# Altium project MCU063A.PrjPcb (part 2 of 5)

## Sheet MCU063A_ADC.SchDoc
size 431 x 279 mm; Date: Not shown in title block; ApprovedBy: Not shown in title block; CheckedBy: Not shown in title block; Author: Not shown in title block; CompanyName: Not shown in title block; DrawnBy: Cody Watkins; Engineer: Not shown in title block; Organization: Not shown in title block; Address1: Not shown in title block; Address2: Not shown in title block; Address3: Not shown in title block; Address4: Not shown in title block; DocumentNumber: 4; Revision: Use project parameter SCH_Rev; SheetNumber: 4; SheetTotal: 11; PageSetup: Record=PageOptions|CenterHorizontal=True|CenterVertical=True|PrintScale=1.00|XCorrection=1.00|YCorrection=1.00|PrintKind=0|BorderSize=5000000|LeftOffset=0|BottomOffset=0|Orientation=2|PaperLength=1000|PaperWidth=1000|Scale=100|PaperSource=15|PrintQuality=600|MediaType=1|DitherType=10|PaperKind=Letter|PrintScaleMode=1; CurrentTime: Not shown in title block; CurrentDate: Not shown in title block; Time: Not shown in title block; DocumentFullPathAndName: Not shown in title block; DocumentName: Not shown in title block; ModifiedDate: Not shown in title block; ImagePath: Not shown in title block
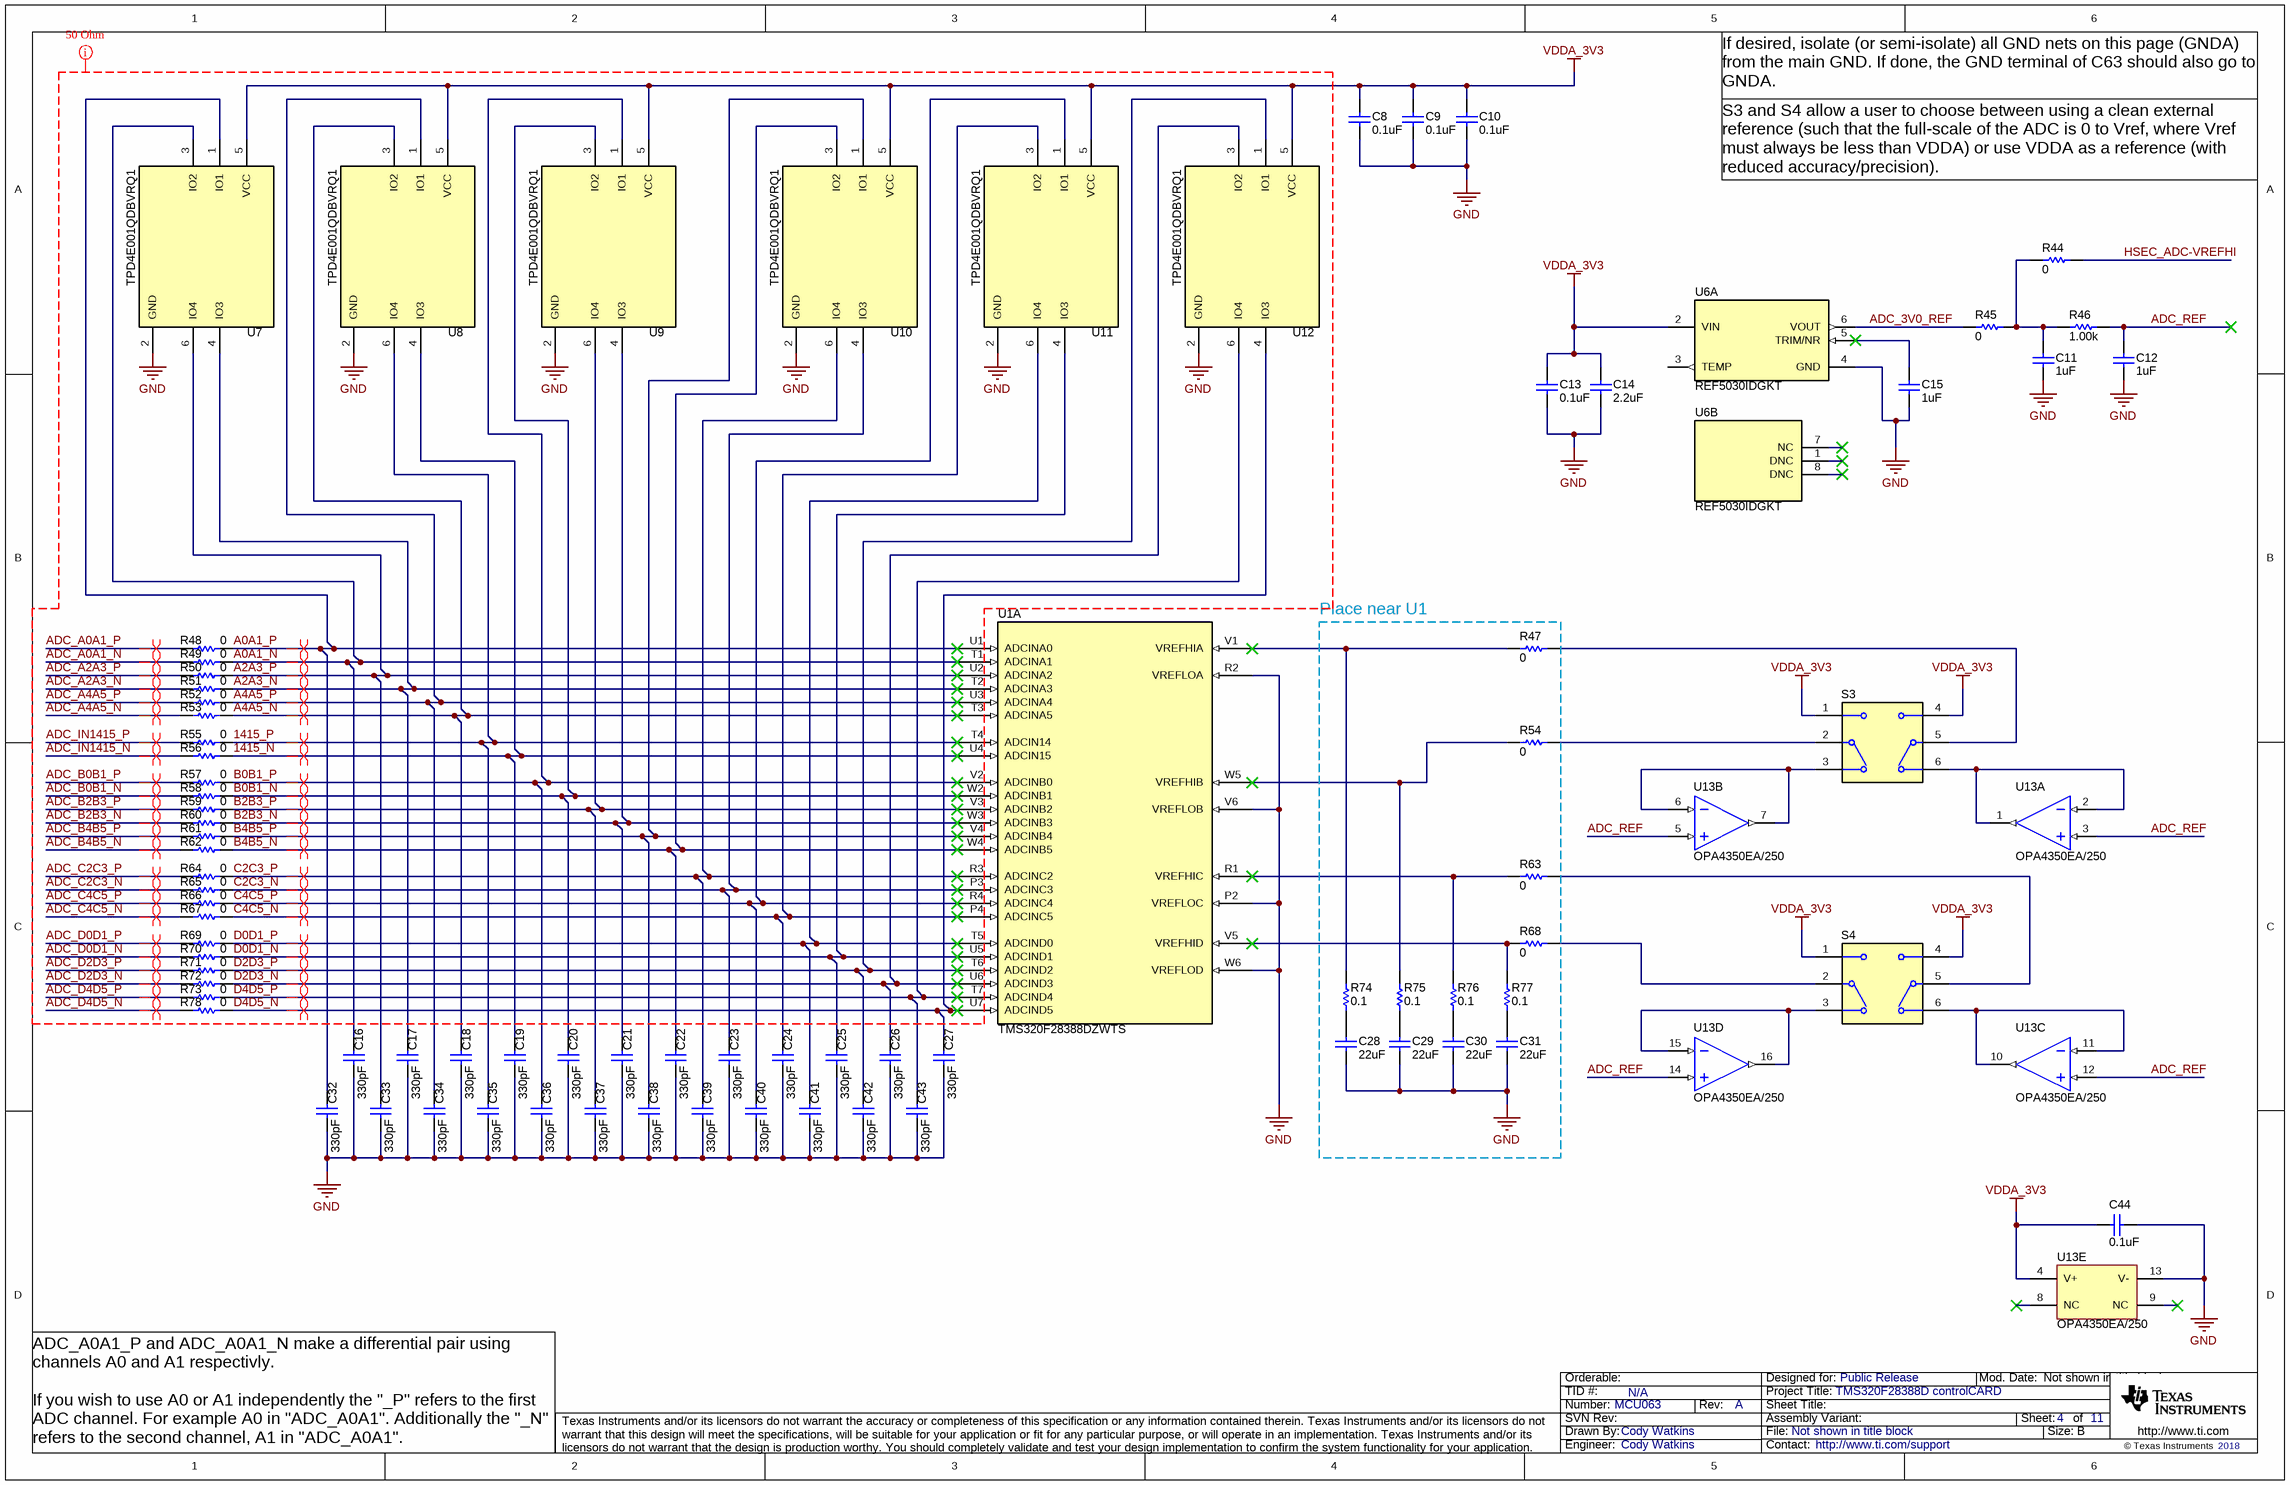
[diagram p3: MCU063A_ADC.SchDoc]

### Parts
C8  ValueDisplayed: 0.1uF  [0603]  (hidden comment: C0603C104K8RACTU)
C9  ValueDisplayed: 0.1uF  [0603]  (hidden comment: C0603C104K8RACTU)
C10  ValueDisplayed: 0.1uF  [0603]  (hidden comment: C0603C104K8RACTU)
C11  ValueDisplayed: 1uF  [0603]  (hidden comment: C0603C105Z9VACTU)
C12  ValueDisplayed: 1uF  [0603]  (hidden comment: C0603C105Z9VACTU)
C13  ValueDisplayed: 0.1uF  [0603]  (hidden comment: C0603C104K8RACTU)
C14  ValueDisplayed: 2.2uF  [0603]  (hidden comment: C0603C225K9PACTU)
C15  ValueDisplayed: 1uF  [0603]  (hidden comment: C0603C105Z9VACTU)
C16  ValueDisplayed: 330pF  [0603]  (hidden comment: C0603C331J5GACTU)
C17  ValueDisplayed: 330pF  [0603]  (hidden comment: C0603C331J5GACTU)
C18  ValueDisplayed: 330pF  [0603]  (hidden comment: C0603C331J5GACTU)
C19  ValueDisplayed: 330pF  [0603]  (hidden comment: C0603C331J5GACTU)
C20  ValueDisplayed: 330pF  [0603]  (hidden comment: C0603C331J5GACTU)
C21  ValueDisplayed: 330pF  [0603]  (hidden comment: C0603C331J5GACTU)
C22  ValueDisplayed: 330pF  [0603]  (hidden comment: C0603C331J5GACTU)
C23  ValueDisplayed: 330pF  [0603]  (hidden comment: C0603C331J5GACTU)
C24  ValueDisplayed: 330pF  [0603]  (hidden comment: C0603C331J5GACTU)
C25  ValueDisplayed: 330pF  [0603]  (hidden comment: C0603C331J5GACTU)
C26  ValueDisplayed: 330pF  [0603]  (hidden comment: C0603C331J5GACTU)
C27  ValueDisplayed: 330pF  [0603]  (hidden comment: C0603C331J5GACTU)
C28  ValueDisplayed: 22uF  [0603]  (hidden comment: GRM188R61A226ME15D)
C29  ValueDisplayed: 22uF  [0603]  (hidden comment: GRM188R61A226ME15D)
C30  ValueDisplayed: 22uF  [0603]  (hidden comment: GRM188R61A226ME15D)
C31  ValueDisplayed: 22uF  [0603]  (hidden comment: GRM188R61A226ME15D)
C32  ValueDisplayed: 330pF  [0603]  (hidden comment: C0603C331J5GACTU)
C33  ValueDisplayed: 330pF  [0603]  (hidden comment: C0603C331J5GACTU)
C34  ValueDisplayed: 330pF  [0603]  (hidden comment: C0603C331J5GACTU)
C35  ValueDisplayed: 330pF  [0603]  (hidden comment: C0603C331J5GACTU)
C36  ValueDisplayed: 330pF  [0603]  (hidden comment: C0603C331J5GACTU)
C37  ValueDisplayed: 330pF  [0603]  (hidden comment: C0603C331J5GACTU)
C38  ValueDisplayed: 330pF  [0603]  (hidden comment: C0603C331J5GACTU)
C39  ValueDisplayed: 330pF  [0603]  (hidden comment: C0603C331J5GACTU)
C40  ValueDisplayed: 330pF  [0603]  (hidden comment: C0603C331J5GACTU)
C41  ValueDisplayed: 330pF  [0603]  (hidden comment: C0603C331J5GACTU)
C42  ValueDisplayed: 330pF  [0603]  (hidden comment: C0603C331J5GACTU)
C43  ValueDisplayed: 330pF  [0603]  (hidden comment: C0603C331J5GACTU)
C44  ValueDisplayed: 0.1uF  [0603]  (hidden comment: C0603C104K8RACTU)
R44  ValueDisplayed: 0  [0603]  (hidden comment: CRCW06030000Z0EA)
R45  ValueDisplayed: 0  [0603]  (hidden comment: CRCW06030000Z0EA)
R46  ValueDisplayed: 1.00k  [0603]  (hidden comment: RC0603FR-071KL)
R47  ValueDisplayed: 0  [0603]  (hidden comment: CRCW06030000Z0EA)
R48  ValueDisplayed: 0  [0603]  (hidden comment: CRCW06030000Z0EA)
R49  ValueDisplayed: 0  [0603]  (hidden comment: CRCW06030000Z0EA)
R50  ValueDisplayed: 0  [0603]  (hidden comment: CRCW06030000Z0EA)
R51  ValueDisplayed: 0  [0603]  (hidden comment: CRCW06030000Z0EA)
R52  ValueDisplayed: 0  [0603]  (hidden comment: CRCW06030000Z0EA)
R53  ValueDisplayed: 0  [0603]  (hidden comment: CRCW06030000Z0EA)
R54  ValueDisplayed: 0  [0603]  (hidden comment: CRCW06030000Z0EA)
R55  ValueDisplayed: 0  [0603]  (hidden comment: CRCW06030000Z0EA)
R56  ValueDisplayed: 0  [0603]  (hidden comment: CRCW06030000Z0EA)
R57  ValueDisplayed: 0  [0603]  (hidden comment: CRCW06030000Z0EA)
R58  ValueDisplayed: 0  [0603]  (hidden comment: CRCW06030000Z0EA)
R59  ValueDisplayed: 0  [0603]  (hidden comment: CRCW06030000Z0EA)
R60  ValueDisplayed: 0  [0603]  (hidden comment: CRCW06030000Z0EA)
R61  ValueDisplayed: 0  [0603]  (hidden comment: CRCW06030000Z0EA)
R62  ValueDisplayed: 0  [0603]  (hidden comment: CRCW06030000Z0EA)
R63  ValueDisplayed: 0  [0603]  (hidden comment: CRCW06030000Z0EA)
R64  ValueDisplayed: 0  [0603]  (hidden comment: CRCW06030000Z0EA)
R65  ValueDisplayed: 0  [0603]  (hidden comment: CRCW06030000Z0EA)
R66  ValueDisplayed: 0  [0603]  (hidden comment: CRCW06030000Z0EA)
R67  ValueDisplayed: 0  [0603]  (hidden comment: CRCW06030000Z0EA)
R68  ValueDisplayed: 0  [0603]  (hidden comment: CRCW06030000Z0EA)
R69  ValueDisplayed: 0  [0603]  (hidden comment: CRCW06030000Z0EA)
R70  ValueDisplayed: 0  [0603]  (hidden comment: CRCW06030000Z0EA)
R71  ValueDisplayed: 0  [0603]  (hidden comment: CRCW06030000Z0EA)
R72  ValueDisplayed: 0  [0603]  (hidden comment: CRCW06030000Z0EA)
R73  ValueDisplayed: 0  [0603]  (hidden comment: CRCW06030000Z0EA)
R74  ValueDisplayed: 0.1  [0402]  (hidden comment: ERJ2BWFR100X)
R75  ValueDisplayed: 0.1  [0402]  (hidden comment: ERJ2BWFR100X)
R76  ValueDisplayed: 0.1  [0402]  (hidden comment: ERJ2BWFR100X)
R77  ValueDisplayed: 0.1  [0402]  (hidden comment: ERJ2BWFR100X)
R78  ValueDisplayed: 0  [0603]  (hidden comment: CRCW06030000Z0EA)
S3  CAS-D20TA  [SW_CAS-D20TA]  (value not drawn)
S4  CAS-D20TA  [SW_CAS-D20TA]  (value not drawn)
U1  TMS320F28388DZWTS  [ZWT0337A]  (part A of 5)
U6  REF5030IDGKT  [DGK0008A_N]  (parts A,B of 2)
U7  TPD4E001QDBVRQ1  [DBV0006A_N]
U8  TPD4E001QDBVRQ1  [DBV0006A_N]
U9  TPD4E001QDBVRQ1  [DBV0006A_N]
U10  TPD4E001QDBVRQ1  [DBV0006A_N]
U11  TPD4E001QDBVRQ1  [DBV0006A_N]
U12  TPD4E001QDBVRQ1  [DBV0006A_N]
U13  OPA4350EA/250  [DBQ0016A_N]  (parts A,B,C,D,E of 5)

### Nets
GND: C8.2 C9.2 C10.2 C11.2 C12.2 C13.2 C14.2 C15.2 C16.2 C17.2 C18.2 C19.2 C20.2 C21.2 C22.2 C23.2 C24.2 C25.2 C26.2 C27.2 C28.2 C29.2 C30.2 C31.2 C32.2 C33.2 C34.2 C35.2 C36.2 C37.2 C38.2 C39.2 C40.2 C41.2 C42.2 C43.2 C44.1 U1.P2(VREFLOC) U1.R2(VREFLOA) U1.V6(VREFLOB) U1.W6(VREFLOD) U6.4(GND) U7.2(GND) U8.2(GND) U9.2(GND) U10.2(GND) U11.2(GND) U12.2(GND) U13.13(V-)
VDDA_3V3: C8.1 C9.1 C10.1 C13.1 C14.1 C44.2 S3.1 S3.4 S4.1 S4.4 U6.2(VIN) U7.5(VCC) U8.5(VCC) U9.5(VCC) U10.5(VCC) U11.5(VCC) U12.5(VCC) U13.4(V+)
1415_N: C19.1 R56.1 U1.U4(ADCIN15) U8.4(IO3)
1415_P: C35.1 R55.1 U1.T4(ADCIN14) U8.6(IO4)
A0A1_N: C16.1 R49.1 U1.T1(ADCINA1) U7.3(IO2)
A0A1_P: C32.1 R48.1 U1.U1(ADCINA0) U7.1(IO1)
A2A3_N: C17.1 R51.1 U1.T2(ADCINA3) U7.4(IO3)
A2A3_P: C33.1 R50.1 U1.U2(ADCINA2) U7.6(IO4)
A4A5_N: C18.1 R53.1 U1.T3(ADCINA5) U8.3(IO2)
A4A5_P: C34.1 R52.1 U1.U3(ADCINA4) U8.1(IO1)
ADC_3V0_REF: R45.2 U6.6(VOUT)
ADC_A0A1_N: R49.2
ADC_A0A1_P: R48.2
ADC_A2A3_N: R51.2
ADC_A2A3_P: R50.2
ADC_A4A5_N: R53.2
ADC_A4A5_P: R52.2
ADC_B0B1_N: R58.2
ADC_B0B1_P: R57.2
ADC_B2B3_N: R60.2
ADC_B2B3_P: R59.2
ADC_B4B5_N: R62.2
ADC_B4B5_P: R61.2
ADC_C2C3_N: R65.2
ADC_C2C3_P: R64.2
ADC_C4C5_N: R67.2
ADC_C4C5_P: R66.2
ADC_D0D1_N: R70.2
ADC_D0D1_P: R69.2
ADC_D2D3_N: R72.2
ADC_D2D3_P: R71.2
ADC_D4D5_N: R78.2
ADC_D4D5_P: R73.2
ADC_IN1415_N: R56.2
ADC_IN1415_P: R55.2
ADC_REF: C12.1 R46.2 U13.3(IN_A+) U13.5(IN_B+) U13.12(IN_C+) U13.14(IN_D+)
B0B1_N: C20.1 R58.1 U1.W2(ADCINB1) U9.3(IO2)
B0B1_P: C36.1 R57.1 U1.V2(ADCINB0) U9.1(IO1)
B2B3_N: C21.1 R60.1 U1.W3(ADCINB3) U9.4(IO3)
B2B3_P: C37.1 R59.1 U1.V3(ADCINB2) U9.6(IO4)
B4B5_N: C22.1 R62.1 U1.W4(ADCINB5) U10.3(IO2)
B4B5_P: C38.1 R61.1 U1.V4(ADCINB4) U10.1(IO1)
C2C3_N: C23.1 R65.1 U1.P3(ADCINC3) U10.4(IO3)
C2C3_P: C39.1 R64.1 U1.R3(ADCINC2) U10.6(IO4)
C4C5_N: C24.1 R67.1 U1.P4(ADCINC5) U11.3(IO2)
C4C5_P: C40.1 R66.1 U1.R4(ADCINC4) U11.1(IO1)
D0D1_N: C25.1 R70.1 U1.U5(ADCIND1) U11.4(IO3)
D0D1_P: C41.1 R69.1 U1.T5(ADCIND0) U11.6(IO4)
D2D3_N: C26.1 R72.1 U1.U6(ADCIND3) U12.3(IO2)
D2D3_P: C42.1 R71.1 U1.T6(ADCIND2) U12.1(IO1)
D4D5_N: C27.1 R78.1 U1.U7(ADCIND5) U12.4(IO3)
D4D5_P: C43.1 R73.1 U1.T7(ADCIND4) U12.6(IO4)
HSEC_ADC-VREFHI: R44.1
NetC11_1: C11.1 R44.2 R45.1 R46.1
NetC15_1: C15.1 U6.5(TRIM/NR)
NetC28_1: C28.1 R74.2
NetC29_1: C29.1 R75.2
NetC30_1: C30.1 R76.2
NetC31_1: C31.1 R77.2
NetR47_1: R47.1 S3.5(C)
NetR47_2: R47.2 R74.1 U1.V1(VREFHIA)
NetR54_1: R54.1 S3.2(C)
NetR54_2: R54.2 R75.1 U1.W5(VREFHIB)
NetR63_1: R63.1 S4.5(C)
NetR63_2: R63.2 R76.1 U1.R1(VREFHIC)
NetR68_1: R68.1 S4.2(C)
NetR68_2: R68.2 R77.1 U1.V5(VREFHID)
NetS3_3: S3.3 U13.6(IN_B-) U13.7(OUT_B)
NetS3_6: S3.6 U13.1(OUT_A) U13.2(IN_A-)
NetS4_3: S4.3 U13.15(IN_D-) U13.16(OUT_D)
NetS4_6: S4.6 U13.10(OUT_C) U13.11(IN_C-)

Not connected (* = marked no-connect by the designer): U6 1(DNC)* 3(TEMP) 7(NC)* 8(DNC)*; U13 8(NC)* 9(NC)*

### Layout directives
differential pair: 1415_N, 1415_P, A0A1_N, A0A1_P, A2A3_N, A2A3_P, A4A5_N, A4A5_P, ADC_A0A1_N, ADC_A0A1_P, ADC_A2A3_N, ADC_A2A3_P, ADC_A4A5_N, ADC_A4A5_P, ADC_B0B1_N, ADC_B0B1_P, ADC_B2B3_N, ADC_B2B3_P, ADC_B4B5_N, ADC_B4B5_P, ADC_C2C3_N, ADC_C2C3_P, ADC_C4C5_N, ADC_C4C5_P, ADC_D0D1_N, ADC_D0D1_P, ADC_D2D3_N, ADC_D2D3_P, ADC_D4D5_N, ADC_D4D5_P, ADC_IN1415_N, ADC_IN1415_P, B0B1_N, B0B1_P, B2B3_N, B2B3_P, B4B5_N, B4B5_P, C2C3_N, C2C3_P, C4C5_N, C4C5_P, D0D1_N, D0D1_P, D2D3_N, D2D3_P, D4D5_N, D4D5_P
50 Ohm Impedance: Undefined: 1415_N, 1415_P, A0A1_N, A0A1_P, A2A3_N, A2A3_P, A4A5_N, A4A5_P, ADC_A0A1_N, ADC_A0A1_P, ADC_A2A3_N, ADC_A2A3_P, ADC_A4A5_N, ADC_A4A5_P, ADC_B0B1_N, ADC_B0B1_P, ADC_B2B3_N, ADC_B2B3_P, ADC_B4B5_N, ADC_B4B5_P, ADC_C2C3_N, ADC_C2C3_P, ADC_C4C5_N, ADC_C4C5_P, ADC_D0D1_N, ADC_D0D1_P, ADC_D2D3_N, ADC_D2D3_P, ADC_D4D5_N, ADC_D4D5_P, ADC_IN1415_N, ADC_IN1415_P, B0B1_N, B0B1_P, B2B3_N, B2B3_P, B4B5_N, B4B5_P, C2C3_N, C2C3_P, C4C5_N, C4C5_P, D0D1_N, D0D1_P, D2D3_N, D2D3_P, D4D5_N, D4D5_P, GND

### Notes on the sheet
- If desired, isolate (or semi-isolate) all GND nets on this page (GNDA) from the main GND. If done, the GND terminal of C63 should also go to GNDA.
- S3 and S4 allow a user to choose between using a clean external reference (such that the full-scale of the ADC is 0 to Vref, where Vref must always be less than VDDA) or use VDDA as a reference (with reduced accuracy/precision).
- Place near U1
- ADC_A0A1_P and ADC_A0A1_N make a differential pair using channels A0 and A1 respectivly.
  If you wish to use A0 or A1 independently the "_P" refers to the first ADC channel. For example A0 in "ADC_A0A1". Additionally the "_N" refers to the second channel, A1 in "ADC_A0A1".
- Drawn By:
- SVN Rev:
- Number:
- TID #:
- Orderable:
- Rev:
- Sheet Title:
- File:
- Project Title:
- Designed for:
- Assembly Variant:
- Mod. Date:
- Sheet:
- Size:
- of
- B
- http://www.ti.com
- Texas Instruments and/or its licensors do not warrant the accuracy or completeness of this specification or any information contained therein. Texas Instruments and/or its licensors do not warrant that this design will meet the specifications, will be suitable for your application or fit for any particular purpose, or will operate in an implementation. Texas Instruments and/or its licensors do not warrant that the design is production worthy. You should completely validate and test your design implementation to confirm the system functionality for your application.
- Engineer:
- Contact:
- © Texas Instruments

### Library data of the parts
C8-C10 C13 C44 = CMP-0006862-5: CAP, CERM, 0.1 uF, 10 V, +/- 10%, X7R, 0603; Manufacturer: Kemet; TaMin_C: -55°C; Polarized: N; SizeAreaWB_mm2: 4.68; Value1: Unknown; U/M: EA; Value: 0.1uF; TaMax_C: 125°C; SizeZ_mm: 1; SizeX_mm: 1.6; SizeY_mm: 0.8; Value2: 10V; SizeArea_mm2: 1.28; Cap_F: 100nF; AEC Category: Q200; Supplier Part Number 2: 80-C0603C104K8R; Publisher: Texas Instruments; Supplier 2: Mouser; Supplier Part Number 3: 1640032; TempCo: X7R; Supplier 3: Farnell; Published: 2008-06-19; RoHS: Y; MountType: SMT; Supplier 1: Digi-Key; PackageReference: 0603; Tolerance_%: 10%; Cap_Case: 0603; CompType: Capacitor; LatestRevisionDate: 2017-03-09; PartNumber: C0603C104K8RACTU; AEC Qualified: ?; ComponentLink1Description: Datasheet link; Supplier Part Number 1: 399-1095-1-ND; Technology: Ceramic; ComponentLink1URL: http://www.kemet.com/kemet/web/homepage/kechome.nsf/vapubfiles/F3102_Y5V.pdf/$file/F3102_Y5V.pdf
C11 C12 C15 = CMP-0006871-4: CAP, CERM, 1 uF, 6.3 V, +80/-20%, Y5V, 0603; Manufacturer: Kemet; TaMin_C: -30°C; Polarized: N; SizeAreaWB_mm2: 4.68; Value1: Unknown; U/M: EA; Value: 1uF; TaMax_C: 85°C; Tolerance_%: 80%; SizeZ_mm: 1; SizeX_mm: 1.6; SizeY_mm: 0.8; Value2: 6.3V; SizeArea_mm2: 1.28; Cap_F: 1µF; AEC Category: Q200; Supplier Part Number 2: 80-C0603C105Z9V; Publisher: Texas Instruments; Supplier 2: Mouser; Supplier Part Number 3: 1515067; TempCo: Y5V; Supplier 3: Farnell; Published: 2008-06-19; RoHS: Y; MountType: SMT; Supplier 1: Digi-Key; PackageReference: 0603; Cap_Case: 0603; CompType: Capacitor; LatestRevisionDate: 2017-03-09; PartNumber: C0603C105Z9VACTU; AEC Qualified: ?; ComponentLink1Description: Datasheet link; Supplier Part Number 1: 399-3217-1-ND; Technology: Ceramic; ComponentLink1URL: http://www.kemet.com/kemet/web/homepage/kechome.nsf/vapubfiles/F3102_Y5V.pdf/$file/F3102_Y5V.pdf
C14 = CMP-0006907-5: CAP, CERM, 2.2 uF, 6.3 V, +/- 10%, X5R, 0603; Manufacturer: Kemet; TaMin_C: -55°C; Polarized: N; SizeAreaWB_mm2: 4.68; Value1: Unknown; U/M: EA; Value: 2.2uF; TaMax_C: 85°C; SizeZ_mm: 1; SizeX_mm: 1.6; SizeY_mm: 0.8; Value2: 6.3V; SizeArea_mm2: 1.28; Cap_F: 2.2µF; AEC Category: Q200; Supplier Part Number 2: 80-C0603C225K9P; Publisher: Texas Instruments; Supplier 2: Mouser; Supplier Part Number 3: 1288257; TempCo: X5R; Supplier 3: Farnell; Published: 2008-06-19; RoHS: Y; MountType: SMT; Supplier 1: Digi-Key; PackageReference: 0603; Tolerance_%: 10%; Cap_Case: 0603; CompType: Capacitor; LatestRevisionDate: 2017-03-09; PartNumber: C0603C225K9PACTU; AEC Qualified: ?; ComponentLink1Description: Datasheet link; Supplier Part Number 1: 399-3362-1-ND; Technology: Ceramic; ComponentLink1URL: http://www.kemet.com/kemet/web/homepage/kechome.nsf/vapubfiles/F3102_Y5V.pdf/$file/F3102_Y5V.pdf
C16-C27 C32-C43 = CMP-0006920-4: CAP, CERM, 330 pF, 50 V, +/- 5%, C0G/NP0, 0603; Manufacturer: Kemet; TaMin_C: -55°C; Polarized: N; SizeAreaWB_mm2: 4.68; Value1: Unknown; U/M: EA; Value: 330pF; TaMax_C: 125°C; SizeZ_mm: 1; SizeX_mm: 1.6; SizeY_mm: 0.8; Value2: 50V; SizeArea_mm2: 1.28; AEC Category: Q200; Supplier Part Number 2: 80-C0603C331J5G; Publisher: Texas Instruments; Supplier 2: Mouser; Supplier Part Number 3: 1414634; TempCo: C0G/NP0; Supplier 3: Farnell; Published: 2008-06-19; RoHS: Y; MountType: SMT; Supplier 1: Digi-Key; PackageReference: 0603; Tolerance_%: 5%; Cap_Case: 0603; CompType: Capacitor; LatestRevisionDate: 2017-03-09; PartNumber: C0603C331J5GACTU; AEC Qualified: ?; Cap_F: 330pF; ComponentLink1Description: Datasheet link; Supplier Part Number 1: 399-1068-1-ND; Technology: Ceramic; ComponentLink1URL: http://www.kemet.com/kemet/web/homepage/kechome.nsf/vapubfiles/F3102_Y5V.pdf/$file/F3102_Y5V.pdf
C28-C31 = CMP-0007324-5: CAP, CERM, 22 uF, 10 V, +/- 20%, X5R, 0603; Manufacturer: MuRata; TaMin_C: -55°C; Polarized: N; SizeAreaWB_mm2: 4.68; Value1: Unknown; U/M: EA; Value: 22uF; TaMax_C: 85°C; SizeZ_mm: 1; SizeX_mm: 1.6; SizeY_mm: 0.8; Value2: 10V; SizeArea_mm2: 1.28; Cap_F: 22µF; AEC Category: Q200; Supplier Part Number 2: 68X2786; Publisher: Texas Instruments; Supplier 2: Newark; Supplier Part Number 3: 81-GRM188R61A226ME5D; TempCo: X5R; Supplier 3: Mouser; Published: 2008-06-19; RoHS: Y; MountType: SMT; Supplier 1: Digi-Key; PackageReference: 0603; Tolerance_%: 20%; Cap_Case: 0603; CompType: Capacitor; LatestRevisionDate: 2017-03-09; PartNumber: GRM188R61A226ME15D; AEC Qualified: ?; ComponentLink1Description: Datasheet link; Supplier Part Number 1: 490-10476-1-ND; Technology: Ceramic; ComponentLink1URL: http://psearch.murata.com/capacitor/product/GRM188R61A226ME15%23.pdf
R44 R45 R47-R73 R78 = CMP-0025697-4: RES, 0, 5%, 0.1 W, AEC-Q200 Grade 0, 0603; Manufacturer: Vishay-Dale; Value: 0; Value_Code: 0000; Power_W: 100mW; Value2: 0.1W; VDC_V: 75V; TempCo: 200 ppm/C; EIA_Code: E24; AEC Category: Q200; AEC Qualified: Y; SizeArea_mm2: 1.28; SizeX_mm: 1.6; SizeY_mm: 0.8; SizeZ_mm: 1; CompType: Resistor; PartNumber: CRCW06030000Z0EA; PackageReference: 0603; RoHS: E; Res_ohm: 0; Tolerance_%: 5%; Value1: 5%; MountType: SMT; Technology: Thick Film; ComponentLink1Description: Datasheet link; ComponentLink1URL: http://www.vishay.com/docs/20035/dcrcwe3.pdf; Supplier 1: Digi-Key; Supplier Part Number 1: 541-0.0GCT-ND; Supplier 2: Newark; Supplier Part Number 2: 52K8014; Supplier 3: Mouser; Supplier Part Number 3: 71-CRCW0603-0-E3; AEC Grade: 0
R46 = CMP-0022895-5: RES, 1.00 k, 1%, 0.1 W, 0603; Manufacturer: Yageo; Power_W: 100mW; TempCo: 100 ppm/C; Value_Code: 1k00; Value: 1.00k; EIA_Code: E96; Res_ohm: 1k; SizeX_mm: 1.6; SizeY_mm: 0.8; SizeZ_mm: 1; Value2: 0.1W; SizeArea_mm2: 1.28; AEC Qualified: N; VDC_V: 75V; AEC Category: Q200; SizeAreaWB_mm2: 4.68; Supplier Part Number 2: 603-RC0603FR-071KL; Supplier 2: Mouser; Supplier Part Number 3: 9238484; Supplier 3: Farnell; RoHS: Y; Value1: 1%; MountType: SMT; Supplier 1: Digi-Key; PackageReference: 0603; Tolerance_%: 1%; CompType: Resistor; PartNumber: RC0603FR-071KL; ComponentLink1Description: Datasheet link; Supplier Part Number 1: 311-1.00KHRCT-ND; Technology: Thick Film; ComponentLink1URL: http://www.yageo.com/pdf/Pu-RC0603_51_PbFree_L_2.pdf; AEC Grade: N/A
R74-R77 = CMP-0078660-1: RES, 0.1, 1%, 0.25 W, 0402; Manufacturer: Panasonic; Power_W: 250mW; TempCo: 300 ppm/C; Value_Code: R100; Value: 0.1; EIA_Code: E96; Res_ohm: 1d; SizeX_mm: 1; SizeY_mm: 0.5; SizeZ_mm: 0.6; Value2: 0.25W; AEC Qualified: N; AEC Category: Q200; ComponentLink1URL: https://industrial.panasonic.com/cdbs/www-data/pdf/RDN0000/AOA0000C313.pdf; Supplier Part Number 2: 667-ERJ-2BWFR100X; Supplier 2: Mouser; RoHS: Y; Value1: 1%; MountType: SMT; Supplier 1: Digi-Key; PackageReference: 0402; Tolerance_%: 1%; SizeArea_mm2: 0.5; CompType: Resistor; PartNumber: ERJ2BWFR100X; ComponentLink1Description: Datasheet link; AEC Grade: N/A; Supplier Part Number 1: P17368CT-ND; Technology: Thick Film
S3 S4 = CMP-0002233-1: Switch, Dual SPDT,  2 Pos, 0.1A, 6VDC, SMD; Manufacturer: Copal Electronics; CurrentRating_mA: 100A; SwitchFunction: On-On; VDC_V: 6V; PositionCount: 2; ComponentLink1Description: Datasheet Link; LatestRevisionDate: 2017-03-09; PackageReference: 5.4x3.9mm; Publisher: Texas Instruments; Supplier 1: Digi-Key; ComponentLink1URL: http://www.nidec-copal-electronics.com/e/catalog/switch/cas.pdf; Supplier Part Number 1: CASD20JCT-ND; MountType: SMT; Circuit: SPDT; Orientation: Top Actuated; PartNumber: CAS-D20TA; CompType: Switch; RoHS: Y
U1 = CMP-0081777-3: TMS320F28388DZWTS, ZWT0337A (NFBGA-337); Manufacturer: Texas Instruments; SizeAreaWB_mm2: 324; SizeArea_mm2: 256; AEC Qualified: N; AEC Category: Q200; SizeZ_mm: 1.4; SizeY_mm: 16; CompType: IC; ComponentLink1Description: Datasheet Link; ComponentLink2Description: Product Folder; PackageReference: ZWT0337A; PartNumber: TMS320F28388DZWTS; PackageDescription: NFBGA-337; ComponentLink2URL: http://www.ti.com/product/tms320f28388d; Alternate Manufacturer: Texas Instruments; ComponentLink3URL: http://www.ti.com/product/tms320f28388d/datasheet; ComponentLink1URL: http://www.ti.com/lit/ds/symlink/tms320f28388d.pdf; MountType: SMT; ComponentLink3Description: Online Datasheet; SizeX_mm: 16
U6 = CMP-0032596-2: Low Noise, Very Low Drift, Precision Series Voltage Reference, DGK0008A (VSSOP-8); Manufacturer: Texas Instruments; Temp Coeff(Max)(ppm/ degree C): 3; Iout/Iz(Max)(mA): 10; VI(Min)(V): 3.2; Eco-Plan: Green (RoHS & no Sb/Br); Initial Accuracy @ 25/deg C(%): 0.05; Iq(Max)(uA): 1000; VI(Max)(V): 18; Rating: Catalog; AEC Category: Q200; AEC Qualified: N; CompType: IC; SizeAreaWB_mm2: 23.6; SizeArea_mm2: 14.7; SizeX_mm: 4.9; SizeZ_mm: 1.1; PackageDescription: VSSOP-8; ComponentLink3URL: http://www.ti.com/product/ref5030/datasheet; PackageVersion: 4073329/E; DatasheetVersion: SBOS410E; VO(V): 3; PartNumber: REF5030IDGKT; ComponentLink3Description: Online Datasheet; ComponentLink2URL: http://www.ti.com/product/ref5030; ComponentLink1Description: Datasheet Link; Code_JEDEC: MO-187-AA; PackageReference: DGK0008A; SubFamily: Series Voltage Reference; ComponentLink1URL: http://www.ti.com/lit/ds/symlink/ref5030.pdf; ComponentLink2Description: Product Folder; MountType: SMT; RoHS: Y; SizeY_mm: 3
U7-U12 = CMP-0066599-1: Automotive Low-Capacitance 4-Channel +/-15-kV ESD Protection Array for High-Speed Data Interfaces, DBV0006A (SOT-23-6); Alternate Manufacturer: Texas Instruments; SizeAreaWB_mm2: 14.82; U/M: EA; SizeZ_mm: 1.45; SizeX_mm: 2.8; SizeY_mm: 2.9; SizeArea_mm2: 8.12; CompType: IC; ComponentLink1URL: http://www.ti.com/lit/ds/symlink/tpd4e001-q1.pdf; Publisher: Texas Instruments; PackageDescription: SOT-23-6; RoHS: Y; Footprint Path 6: C:\AltiumLibraries\Footprints\TI\.PcbLib; MountType: SMT; Manufacturer: Texas Instruments; PackageReference: DBV0006A; LatestRevisionDate: 2017-06-09; PartNumber: TPD4E001QDBVRQ1; ComponentLink1Description: Datasheet Link
U13 = CMP-0041147-1: High-Speed, Single-Supply, Rail-to-Rail Operational Amplifier MicroAmplifier(TM) Series, 2.7 to 5.5 V, -55 to 150 degC, 16-pin SOP (DBQ16), Green (RoHS & no Sb/Br); Manufacturer: Texas Instruments; Number of Channels: 4; Vio (25C)(Max)(mV): 0.5; Total Supply Voltage(Min)(+5V is 5, +/-5V is 10): 2.7; Slew Rate(Typ)(V/us): 22; Total Supply Voltage(Max)(+5V is 5, +/-5V is 10): 5.5; Iq per channel(Max)(mA): 7.5; Vn at 1kHz(Typ)(nV/rtHz): 18; Sub Family: Low Input Bias Current Amp (<=10pA), Low Offset Voltage Amplifier (<=500uV), Low Supply Voltage Amplifier (<=2.7V), Precision Amplifier; IIB(Max)(pA): 10; CMRR(Min)(dB): 66; Mounting Technology: Surface Mount; ComponentLink3URL: http://www.ti.com/litv/pdf/msoi004g; ComponentLink1URL: http://www.ti.com/; PackageDescription: 16-Pin, Plastic Small Outline, Body 3.9 x 4.9 mm, Pitch 0.635 mm; Eco-Plan: Green (RoHS & no Sb/Br); ComponentLink1Description: Manufacturer URL; ComponentLink2URL: http://www.ti.com/general/docs/lit/getliterature.tsp?genericPartNumber=OPA4350&fileType=pdf; PackageVersion: 4073301-2/H, 10/2008; Code_JEDEC: MO-137; Offset Drift(Typ)(uV/C): 4; ComponentLink3Description: Package Specification; ComponentLink2Description: Datasheet; DatasheetVersion: SBOS099C; PartNumber: OPA4350EA/250; PackageReference: DBQ0016A